# Altium project TP1_ASSD.PrjPcb
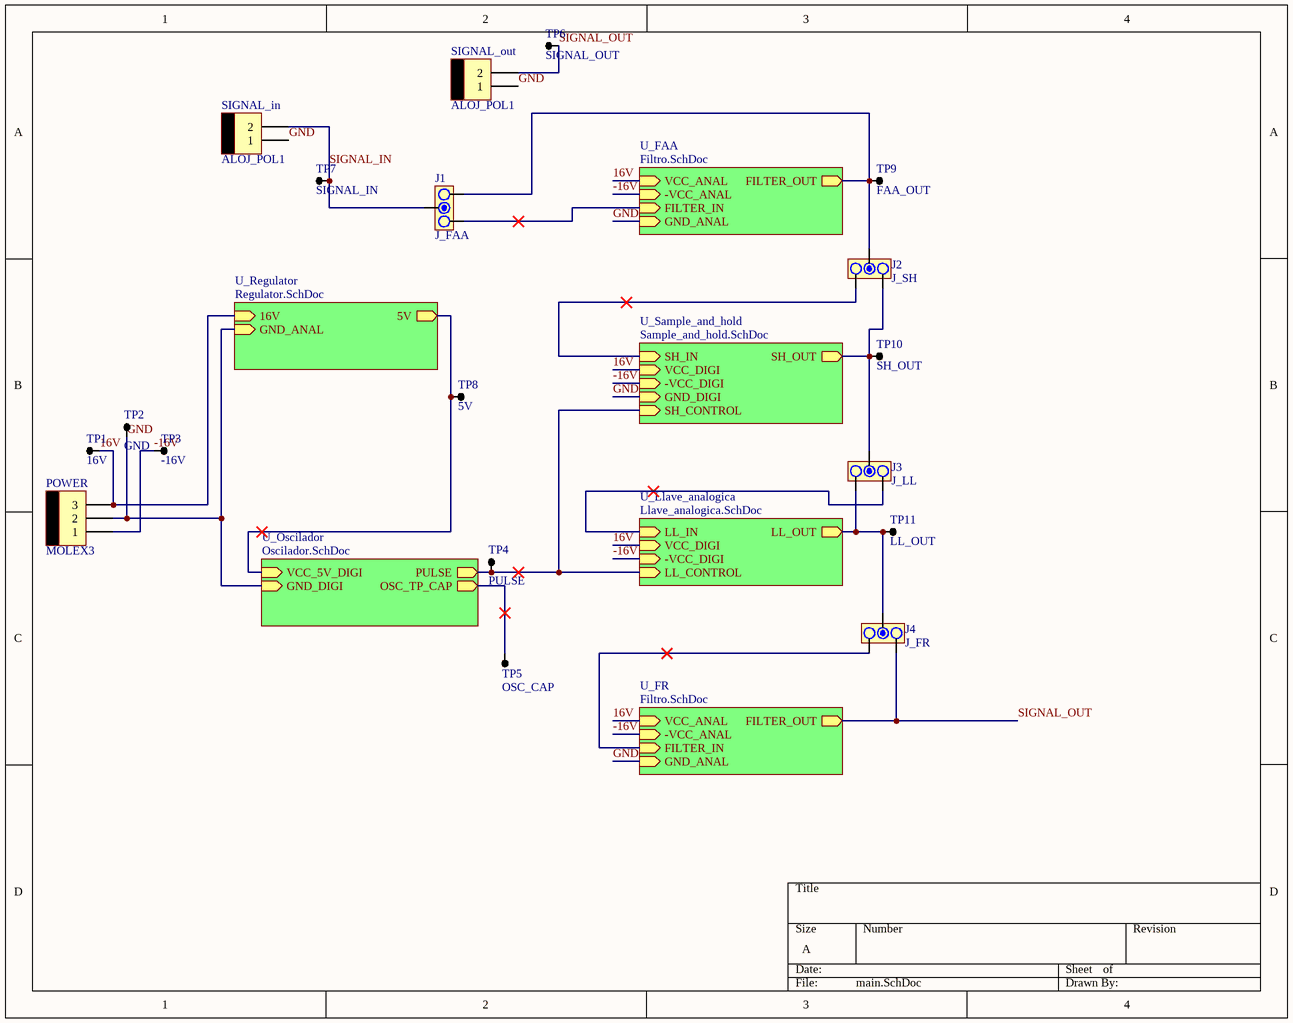
[diagram p0: main.SchDoc]
6 sheets, 113 parts. Net scope: hierarchical (ports join the sheet entries above them; power ports are global).
Board file: placaConversor.PcbDoc
Sheets:
  main.SchDoc
    U_Oscilador = Oscilador.SchDoc
    U_FAA = Filtro.SchDoc
    U_FR = Filtro.SchDoc
    U_Llave_analogica = Llave_analogica.SchDoc
    U_Sample_and_hold = Sample_and_hold.SchDoc
    U_Regulator = Regulator.SchDoc

## Sheet main.SchDoc
size A

### Parts
J1  J_FAA  [JUMPER3]
J2  J_SH  [JUMPER3]
J3  J_LL  [JUMPER3]
J4  J_FR  [JUMPER3]
POWER  MOLEX3  [MOLEX3]
SIGNAL_in  ALOJ_POL1  [MOLEX2]
SIGNAL_out  ALOJ_POL1  [MOLEX2]
TP1  16V  [TPTH]
TP2  GND  [TPTH]
TP3  -16V  [TPTH]
TP4  PULSE  [TPTH]
TP5  OSC_CAP  [TPTH]
TP6  SIGNAL_OUT  [TPTH]
TP7  SIGNAL_IN  [TPTH]
TP8  5V  [TPTH]
TP9  FAA_OUT  [TPTH]
TP10  SH_OUT  [TPTH]
TP11  LL_OUT  [TPTH]

### Sub-sheets
U_FAA = Filtro.SchDoc: VCC_ANAL (in), -VCC_ANAL (in), FILTER_IN (in), FILTER_OUT (out), GND_ANAL (in)
U_FR = Filtro.SchDoc: VCC_ANAL (in), -VCC_ANAL (in), FILTER_IN (in), FILTER_OUT (out), GND_ANAL (in)
U_Llave_analogica = Llave_analogica.SchDoc: LL_IN (in), LL_OUT (out), VCC_DIGI (in), -VCC_DIGI (in), LL_CONTROL (in)
U_Oscilador = Oscilador.SchDoc: VCC_5V_DIGI (in), PULSE (out), GND_DIGI (in), OSC_TP_CAP (out)
U_Regulator = Regulator.SchDoc: 16V (in), 5V (out), GND_ANAL (in)
U_Sample_and_hold = Sample_and_hold.SchDoc: SH_IN (in), SH_OUT (out), VCC_DIGI (in), -VCC_DIGI (in), GND_DIGI (in), SH_CONTROL (in)

### Nets
16V: POWER.3 TP1.1 ; sheet U_FAA/VCC_ANAL, sheet U_FR/VCC_ANAL, sheet U_Llave_analogica/VCC_DIGI, sheet U_Sample_and_hold/VCC_DIGI, sheet U_Regulator/16V
-16V: POWER.1 TP3.1 ; sheet U_FAA/-VCC_ANAL, sheet U_FR/-VCC_ANAL, sheet U_Llave_analogica/-VCC_DIGI, sheet U_Sample_and_hold/-VCC_DIGI
fin: J1.3 ; sheet U_FAA/FILTER_IN
fin: J4.3 ; sheet U_FR/FILTER_IN  [a separate net that carries the same name]
fout: J1.1 J2.2 TP9.1 ; sheet U_FAA/FILTER_OUT
GND: POWER.2 SIGNAL_in.1 SIGNAL_out.1 TP2.1 ; sheet U_Oscilador/GND_DIGI, sheet U_FAA/GND_ANAL, sheet U_FR/GND_ANAL, sheet U_Sample_and_hold/GND_DIGI, sheet U_Regulator/GND_ANAL  [project net fgnd]
SIGNAL_IN: J1.2 SIGNAL_in.2 TP7.1
SIGNAL_OUT: J4.1 SIGNAL_out.2 TP6.1 ; sheet U_FR/FILTER_OUT  [project net fout]
NetD1_1: TP5.1 ; sheet U_Oscilador/OSC_TP_CAP
NetJ2_1: J2.1 J3.2 TP10.1 ; sheet U_Sample_and_hold/SH_OUT
NetJ2_3: J2.3 ; sheet U_Sample_and_hold/SH_IN
NetJ3_1: J3.1 ; sheet U_Llave_analogica/LL_IN
NetJ3_3: J3.3 J4.2 TP11.1 ; sheet U_Llave_analogica/LL_OUT
NetLL_U1_13: TP4.1 ; sheet U_Oscilador/PULSE, sheet U_Llave_analogica/LL_CONTROL, sheet U_Sample_and_hold/SH_CONTROL
NetOSC_CD1_1: TP8.1 ; sheet U_Oscilador/VCC_5V_DIGI, sheet U_Regulator/5V

### Library data of the parts
J1-J4 = JUMPER3
SIGNAL_in SIGNAL_out = MOLEX2
TP1-TP11 = TP

## Sheet Oscilador.SchDoc
size A
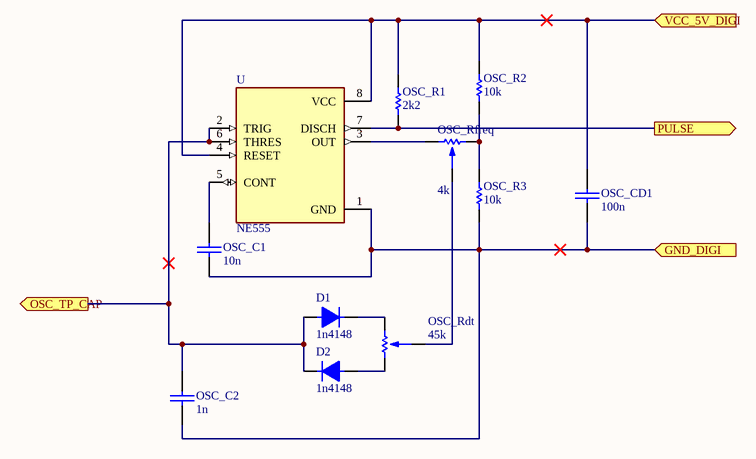
[diagram p1: Oscilador.SchDoc]

### Parts
D1  1n4148  [DO41]
D2  1n4148  [DO41]
OSC_C1  10n  [CAP200]
OSC_C2  1n  [CAP200]
OSC_CD1  100n  [CAP200]
OSC_R1  2k2  [RES400]
OSC_R2  10k  [RES400]
OSC_R3  10k  [RES400]
OSC_Rdt  45k  [POTENCIOMETRO]
OSC_Rfreq  4k  [POTENCIOMETRO]
U  NE555  [DIP794W45P254L1060H508Q8]

### Ports
GND_DIGI (in), OSC_TP_CAP (out), PULSE (out), VCC_5V_DIGI (in)

### Nets
fgnd: OSC_C1.2 OSC_C2.2 OSC_CD1.2 OSC_R3.1 U.1(GND) ; port GND_DIGI
NetD1_1: D1.1 D2.2 OSC_C2.1 U.2(TRIG) U.6(THRES) ; port OSC_TP_CAP
NetD1_2: D1.2 OSC_Rdt.1
NetD2_1: D2.1 OSC_Rdt.3
NetLL_U1_13: OSC_R1.1 U.7(DISCH) ; port PULSE
NetOSC_C1_1: OSC_C1.1 U.5(CONT)
NetOSC_CD1_1: OSC_CD1.1 OSC_R1.2 OSC_R2.2 U.4(RESET) U.8(VCC) ; port VCC_5V_DIGI
NetOSC_R2_1: OSC_R2.1 OSC_R3.2 OSC_Rfreq.1
NetOSC_Rdt_2: OSC_Rdt.2 OSC_Rfreq.2
NetOSC_Rfreq_3: OSC_Rfreq.3 U.3(OUT)

### Library data of the parts
D1 D2 = DIODO
OSC_C1 OSC_C2 OSC_CD1 = CAP
OSC_R1-OSC_R3 = RES
OSC_Rdt OSC_Rfreq = POTENCIOMETRO
U = NE555: 555 Type, Timer/Oscillator _Single_ IC 100kHz 8-SOIC; MF: Texas Instruments; Package: SOIC-8 Conrad; Availability: Unavailable; MP: NE555; Value: *; SnapEDA_Link: https://www.snapeda.com/parts/NE555/Texas%20Instruments/view-part/1756807/?ref=snap; Price: None

## Sheet Filtro.SchDoc
size A
Used 2 times, as channels U_FAA, U_FR. Parts and nets are listed once, with the designators drawn on the sheet.
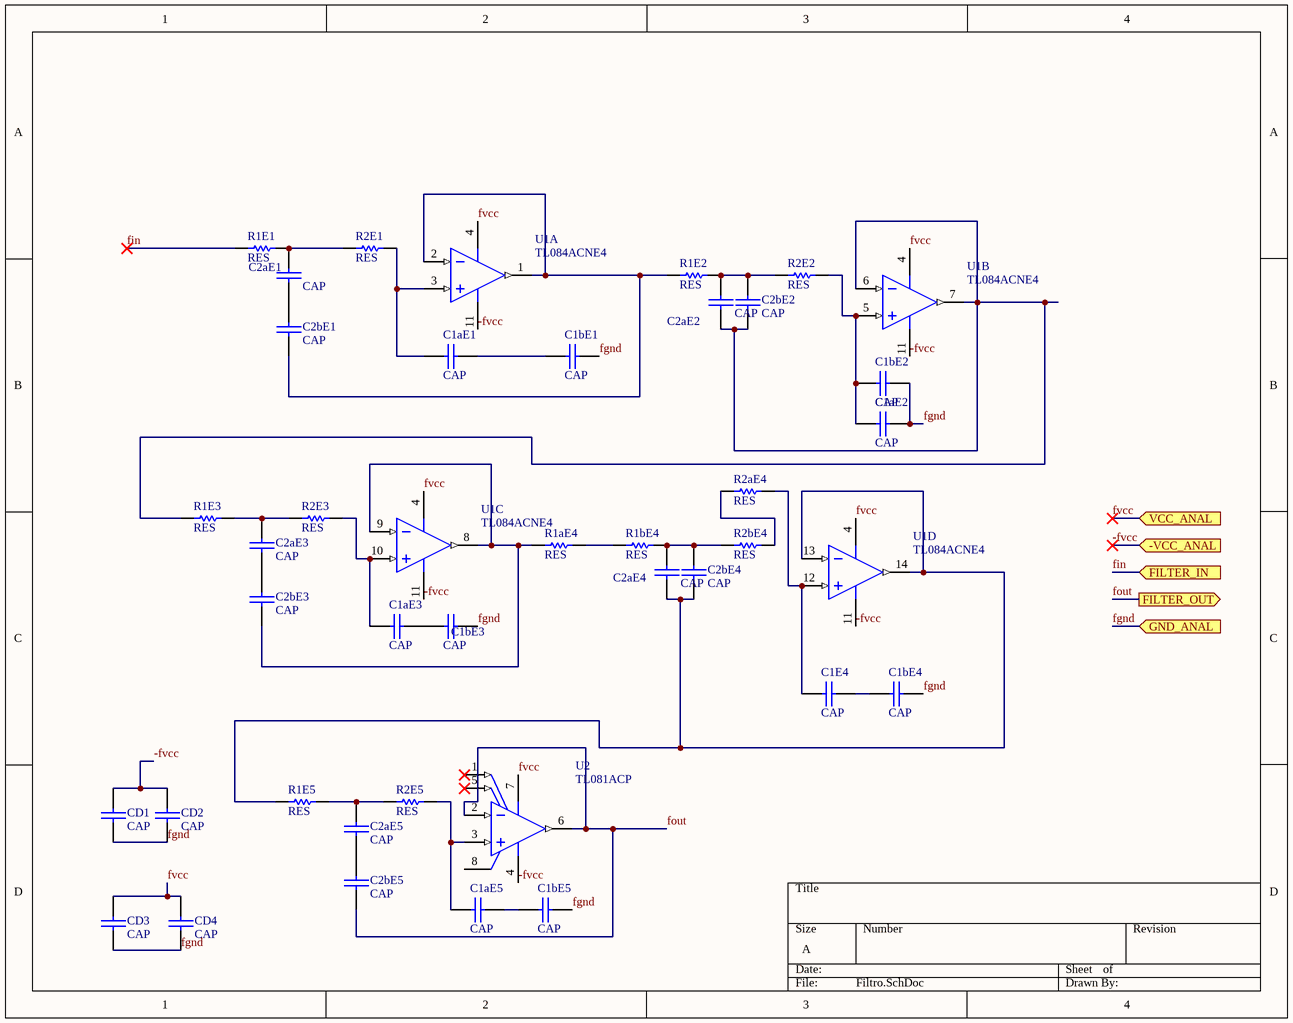
[diagram p2: Filtro.SchDoc]

### Parts
C1aE1  CAP  [0805]
C1aE2  CAP  [0805]
C1aE3  CAP  [0805]
C1aE5  CAP  [0805]
C1bE1  CAP  [0805]
C1bE2  CAP  [0805]
C1bE3  CAP  [0805]
C1bE4  CAP  [0805]
C1bE5  CAP  [0805]
C1E4  CAP  [0805]
C2aE1  CAP  [0805]
C2aE2  CAP  [0805]
C2aE3  CAP  [0805]
C2aE4  CAP  [0805]
C2aE5  CAP  [0805]
C2bE1  CAP  [0805]
C2bE2  CAP  [0805]
C2bE3  CAP  [0805]
C2bE4  CAP  [0805]
C2bE5  CAP  [0805]
CD1  CAP  [0805]
CD2  CAP  [0805]
CD3  CAP  [0805]
CD4  CAP  [0805]
R1aE4  RES  [0805]
R1bE4  RES  [0805]
R1E1  RES  [0805]
R1E2  RES  [0805]
R1E3  RES  [0805]
R1E5  RES  [0805]
R2aE4  RES  [0805]
R2bE4  RES  [0805]
R2E1  RES  [0805]
R2E2  RES  [0805]
R2E3  RES  [0805]
R2E5  RES  [0805]
U1  TL084ACNE4  [TI-N14]  (parts A,B,C,D of 4)
U2  TL081ACP  [TI-P8]

### Ports
-VCC_ANAL (in), FILTER_IN (in), FILTER_OUT (out), GND_ANAL (in), VCC_ANAL (in)

### Nets
-fvcc: CD1.1 CD2.1 U1.11(VCC-) U2.4(VCC-) ; port -VCC_ANAL
fgnd: C1aE2.2 C1bE1.2 C1bE2.2 C1bE3.2 C1bE4.2 C1bE5.2 CD1.2 CD2.2 CD3.2 CD4.2 ; port GND_ANAL
fin: R1E1.1 ; port FILTER_IN
fout: C2bE5.2 U2.2(IN-) U2.6(OUT) ; port FILTER_OUT
fvcc: CD3.1 CD4.1 U1.4(VCC+) U2.7(VCC+) ; port VCC_ANAL
NetC1aE1_1: C1aE1.1 R2E1.2 U1.3(IN1+)
NetC1aE1_2: C1aE1.2 C1bE1.1
NetC1aE2_1: C1aE2.1 C1bE2.1 R2E2.2 U1.5(IN2+)
NetC1aE3_1: C1aE3.1 R2E3.2 U1.10(IN3+)
NetC1aE3_2: C1aE3.2 C1bE3.1
NetC1aE5_1: C1aE5.1 R2E5.2 U2.3(IN+)
NetC1aE5_2: C1aE5.2 C1bE5.1
NetC1bE4_1: C1bE4.1 C1E4.2
NetC1E4_1: C1E4.1 R2aE4.2 U1.12(IN4+)
NetC2aE1_1: C2aE1.1 R1E1.2 R2E1.1
NetC2aE1_2: C2aE1.2 C2bE1.1
NetC2aE2_1: C2aE2.1 C2bE2.1 R1E2.2 R2E2.1
NetC2aE2_2: C2aE2.2 C2bE2.2 R1E3.1 U1.6(IN2-) U1.7(OUT2)
NetC2aE3_1: C2aE3.1 R1E3.2 R2E3.1
NetC2aE3_2: C2aE3.2 C2bE3.1
NetC2aE4_1: C2aE4.1 C2bE4.1 R1bE4.2 R2bE4.1
NetC2aE4_2: C2aE4.2 C2bE4.2 R1E5.1 U1.13(IN4-) U1.14(OUT4)
NetC2aE5_1: C2aE5.1 R1E5.2 R2E5.1
NetC2aE5_2: C2aE5.2 C2bE5.1
NetC2bE1_2: C2bE1.2 R1E2.1 U1.1(OUT1) U1.2(IN1-)
NetC2bE3_2: C2bE3.2 R1aE4.1 U1.8(OUT3) U1.9(IN3-)
NetR1aE4_2: R1aE4.2 R1bE4.1
NetR2aE4_1: R2aE4.1 R2bE4.2

Not connected (* = marked no-connect by the designer): U2 1(OFFSET_N1)* 5(OFFSET_N2)* 8(NC)

### Channels
U_FAA: designators end in _U_FAA; ports -VCC_ANAL=-16V FILTER_IN=fin FILTER_OUT=fout GND_ANAL=fgnd VCC_ANAL=16V
U_FR: designators end in _U_FR; ports -VCC_ANAL=-16V FILTER_IN=fin FILTER_OUT=fout GND_ANAL=fgnd VCC_ANAL=16V

### Library data of the parts
U1 = TL084ACNE4: JFET-Input Operational Amplifier, 7 to 36 V, 0 to 70 degC, 14-pin DIP (N14), Pb-Free (RoHS); Manufacturer: Texas Instruments; CMRR(Min)(dB): 75; GBW(Typ)(MHz): 3; IIB(Max)(pA): 200; Iq per channel(Max)(mA): 2.8; Number of Channels: 4; Offset Drift(Typ)(uV/C): 18; Rating: Catalog; Slew Rate(Typ)(V/us): 13; Sub Family: General Purpose Amplifier, High Supply Voltage Amplifier (>=30V); Total Supply Voltage(Max)(+5V is 5, +/-5V is 10): 36; Total Supply Voltage(Min)(+5V is 5, +/-5V is 10): 7; Vio (25C)(Max)(mV): 6; DatasheetVersion: SLOS081G; PackageVersion: 4040049/E, 12/2002; PackageReference: N14; PackageDescription: 14-Pin Plastic In-Line, Body 19.305 x 6.35 mm, Pitch 2.54 mm; Supplier 1: Digi-Key; Supplier Part Number 1: TL084ACNE4-ND; Supplier 2: Mouser; Supplier Part Number 2: 595-TL084ACNE4; Eco-Plan: Pb-Free (RoHS); Vn at 1kHz(Typ)(nV/rtHz): 18; Mounting Technology: Through Hole; Code_JEDEC: MS-001; PartNumber: TL084ACNE4; ComponentLink1Description: Manufacturer URL; ComponentLink1URL: http://www.ti.com/; ComponentLink2Description: Datasheet; ComponentLink2URL: http://www.ti.com/lit/ds/symlink/tl084a.pdf; ComponentLink3Description: Package Specification; ComponentLink3URL: http://www.ti.com/lit/ml/mpdi002c/mpdi002c.pdf
U2 = TL081ACP: JFET-Input Operational Amplifier, 7 to 36 V, 0 to 70 degC, 8-pin DIP (P8), Pb-Free (RoHS); Manufacturer: Texas Instruments; CMRR(Min)(dB): 75; GBW(Typ)(MHz): 3; IIB(Max)(pA): 200; Iq per channel(Max)(mA): 2.8; Number of Channels: 1; Offset Drift(Typ)(uV/C): 18; Rating: Catalog; Slew Rate(Typ)(V/us): 13; Sub Family: General Purpose Amplifier, High Supply Voltage Amplifier (>=30V); Total Supply Voltage(Max)(+5V is 5, +/-5V is 10): 36; Total Supply Voltage(Min)(+5V is 5, +/-5V is 10): 7; Vio (25C)(Max)(mV): 6; DatasheetVersion: SLOS081G; PackageVersion: 4040082/E, 04/2010; PackageReference: P8; PackageDescription: 8-Pin Plastic In-Line, Body 9.59 x 6.35 mm, Pitch 2.54 mm; Supplier 1: Digi-Key; Supplier Part Number 1: 296-7202-5-ND; Supplier 2: Farnell; Supplier Part Number 2: 1133073; Supplier 3: Newark; Supplier Part Number 3: 68K1132; Supplier 4: Mouser; Supplier Part Number 4: 595-TL081ACP; Eco-Plan: Pb-Free (RoHS); Vn at 1kHz(Typ)(nV/rtHz): 18; Mounting Technology: Through Hole; Code_JEDEC: MS-001; PartNumber: TL081ACP; ComponentLink1Description: Manufacturer URL; ComponentLink1URL: http://www.ti.com/; ComponentLink2Description: Datasheet; ComponentLink2URL: http://www.ti.com/lit/ds/symlink/tl081a.pdf; ComponentLink3Description: Package Specification; ComponentLink3URL: http://www.ti.com/litv/pdf/mpdi001b

## Sheet Llave_analogica.SchDoc
size A
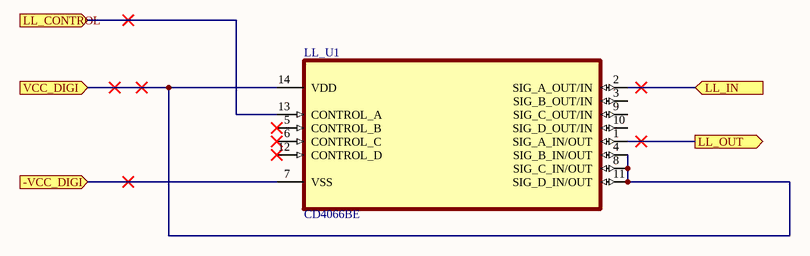
[diagram p3: Llave_analogica.SchDoc]

### Parts
LL_U1  CD4066BE  [DIP254P762X508-14]

### Ports
-VCC_DIGI (in), LL_CONTROL (in), LL_IN (in), LL_OUT (out), VCC_DIGI (in)

### Nets
16V: LL_U1.4(SIG_B_IN/OUT) LL_U1.8(SIG_C_IN/OUT) LL_U1.11(SIG_D_IN/OUT) LL_U1.14(VDD) ; port VCC_DIGI
-16V: LL_U1.7(VSS) ; port -VCC_DIGI
NetJ3_1: LL_U1.2(SIG_A_OUT/IN) ; port LL_IN
NetJ3_3: LL_U1.1(SIG_A_IN/OUT) ; port LL_OUT
NetLL_U1_13: LL_U1.13(CONTROL_A) ; port LL_CONTROL

Not connected (* = marked no-connect by the designer): LL_U1 3(SIG_B_OUT/IN) 5(CONTROL_B)* 6(CONTROL_C)* 9(SIG_C_OUT/IN) 10(SIG_D_OUT/IN) 12(CONTROL_D)*

### Library data of the parts
LL_U1 = CD4066BE: Bilateral, FET Switches 1 x 1:1 14-PDIP; MF: Texas Instruments; SnapEDA_Link: https://www.snapeda.com/parts/CD4066BE/Texas%20Instruments/view-part/2771603/?ref=snap; Price: None; Availability: Unavailable; Package: PDIP-14 RCA; MP: CD4066BE; Value: *

## Sheet Sample_and_hold.SchDoc
size A4
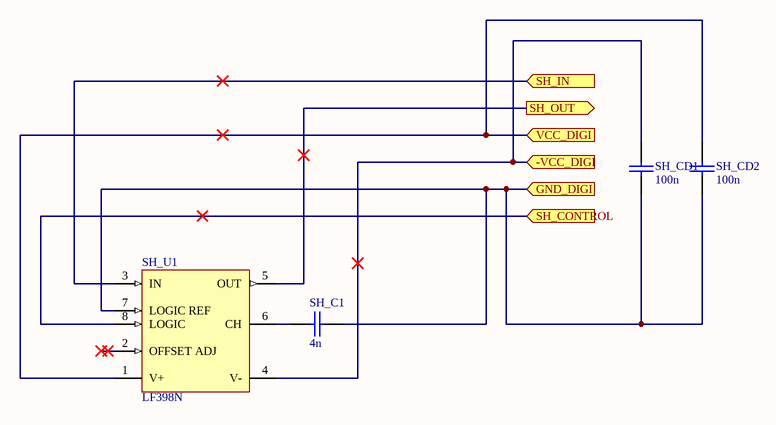
[diagram p4: Sample_and_hold.SchDoc]

### Parts
SH_C1  4n  [CAP200]
SH_CD1  100n  [CAP200]
SH_CD2  100n  [CAP200]
SH_U1  LF398N  [N08E]

### Ports
-VCC_DIGI (in), GND_DIGI (in), SH_CONTROL (in), SH_IN (in), SH_OUT (out), VCC_DIGI (in)

### Nets
16V: SH_CD2.1 SH_U1.1(V+) ; port VCC_DIGI
-16V: SH_CD1.1 SH_U1.4(V-) ; port -VCC_DIGI
fgnd: SH_C1.2 SH_CD1.2 SH_CD2.2 SH_U1.7(LOGIC_REF) ; port GND_DIGI
NetJ2_1: SH_U1.5(OUT) ; port SH_OUT
NetJ2_3: SH_U1.3(IN) ; port SH_IN
NetLL_U1_13: SH_U1.8(LOGIC) ; port SH_CONTROL
NetSH_C1_1: SH_C1.1 SH_U1.6(CH)

Not connected (* = marked no-connect by the designer): SH_U1 2(OFFSET_ADJ)*

### Library data of the parts
SH_C1 SH_CD1 SH_CD2 = CAP
SH_U1 = LF398N: Monolithic Sample and Hold Circuits, 8-pin MDIP; Manufacturer: National Semiconductor; PackageTopMarking: NSUZXYTTE#*LF*398N; PowerWise: N; CompType: Analog IC; PinCount: 8; DatasheetVersion: Jul-2000; Code_JEDEC: MS-001-BA; PackageVersion: revG, May-2006; PackageReference: N08E; PackageDescription: MDIP, .365 x .250 x .130in, 8 Lead, .100in Pitch; RoHS: N; PartNumber: LF398N

## Sheet Regulator.SchDoc
size A
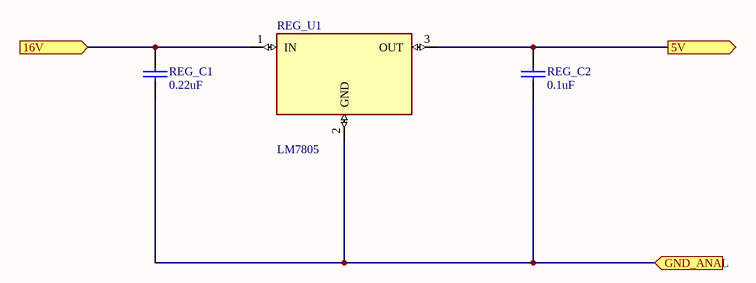
[diagram p5: Regulator.SchDoc]

### Parts
REG_C1  0.22uF  [CAP200]
REG_C2  0.1uF  [CAP200]
REG_U1  LM7805  [TO220]

### Ports
5V (out), 16V (in), GND_ANAL (in)

### Nets
16V: REG_C1.1 REG_U1.1(IN) ; port 16V
fgnd: REG_C1.2 REG_C2.2 REG_U1.2(GND) ; port GND_ANAL
NetOSC_CD1_1: REG_C2.1 REG_U1.3(OUT) ; port 5V

### Library data of the parts
REG_C1 REG_C2 = CAP
REG_U1 = LM7805: Linear Voltage Regulator IC 1 Output 1.5A SOT-223-4; MF: Texas Instruments; Availability: Unavailable; SnapEDA_Link: https://www.snapeda.com/parts/LM7805/Texas%20Instruments/view-part/2302466/?ref=snap; MP: LM7805; Price: None; Value: *; Package: TO-220 Texas Instruments

## Nets that join several sheets
16V: main (POWER.3 TP1.1), U_FAA (CD3_U_FAA.1 CD4_U_FAA.1 U1_U_FAA.4 U2_U_FAA.7), U_FR (CD3_U_FR.1 CD4_U_FR.1 U1_U_FR.4 U2_U_FR.7), Llave_analogica (LL_U1.4 LL_U1.8 LL_U1.11 LL_U1.14), Sample_and_hold (SH_CD2.1 SH_U1.1), Regulator (REG_C1.1 REG_U1.1)
-16V: main (POWER.1 TP3.1), U_FAA (CD1_U_FAA.1 CD2_U_FAA.1 U1_U_FAA.11 U2_U_FAA.4), U_FR (CD1_U_FR.1 CD2_U_FR.1 U1_U_FR.11 U2_U_FR.4), Llave_analogica (LL_U1.7), Sample_and_hold (SH_CD1.1 SH_U1.4)
fgnd: main (POWER.2 SIGNAL_in.1 SIGNAL_out.1 TP2.1), Oscilador (5 pins), U_FAA (10 pins), U_FR (10 pins), Sample_and_hold (SH_C1.2 SH_CD1.2 SH_CD2.2 SH_U1.7), Regulator (REG_C1.2 REG_C2.2 REG_U1.2)
fin: main (J1.3), U_FAA (R1E1_U_FAA.1)
fin: main (J4.3), U_FR (R1E1_U_FR.1)
fout: main (J4.1 SIGNAL_out.2 TP6.1), U_FR (C2bE5_U_FR.2 U2_U_FR.2 U2_U_FR.6)
fout: main (J1.1 J2.2 TP9.1), U_FAA (C2bE5_U_FAA.2 U2_U_FAA.2 U2_U_FAA.6)
NetD1_1: main (TP5.1), Oscilador (5 pins)
NetJ2_1: main (J2.1 J3.2 TP10.1), Sample_and_hold (SH_U1.5)
NetJ2_3: main (J2.3), Sample_and_hold (SH_U1.3)
NetJ3_1: main (J3.1), Llave_analogica (LL_U1.2)
NetJ3_3: main (J3.3 J4.2 TP11.1), Llave_analogica (LL_U1.1)
NetLL_U1_13: main (TP4.1), Oscilador (OSC_R1.1 U.7), Llave_analogica (LL_U1.13), Sample_and_hold (SH_U1.8)
NetOSC_CD1_1: main (TP8.1), Oscilador (5 pins), Regulator (REG_C2.1 REG_U1.3)